# Altium schematic sheet LED.SchDoc: LED Cube 8x8x8 - LED
size A4; Author: Luka Penger; CompanyName: L. Penger; DrawnBy: Luka Penger; Organization: L. Penger; Address1: Luka Penger; Address2: http://lukapenger.eu; Address3: Software & Hardware; Address4: Development; DocumentNumber: 3; Revision: 3.0.0; SheetNumber: 3; SheetTotal: 5; DocumentName: LED; ProjectName: LED Cube 8x8x8
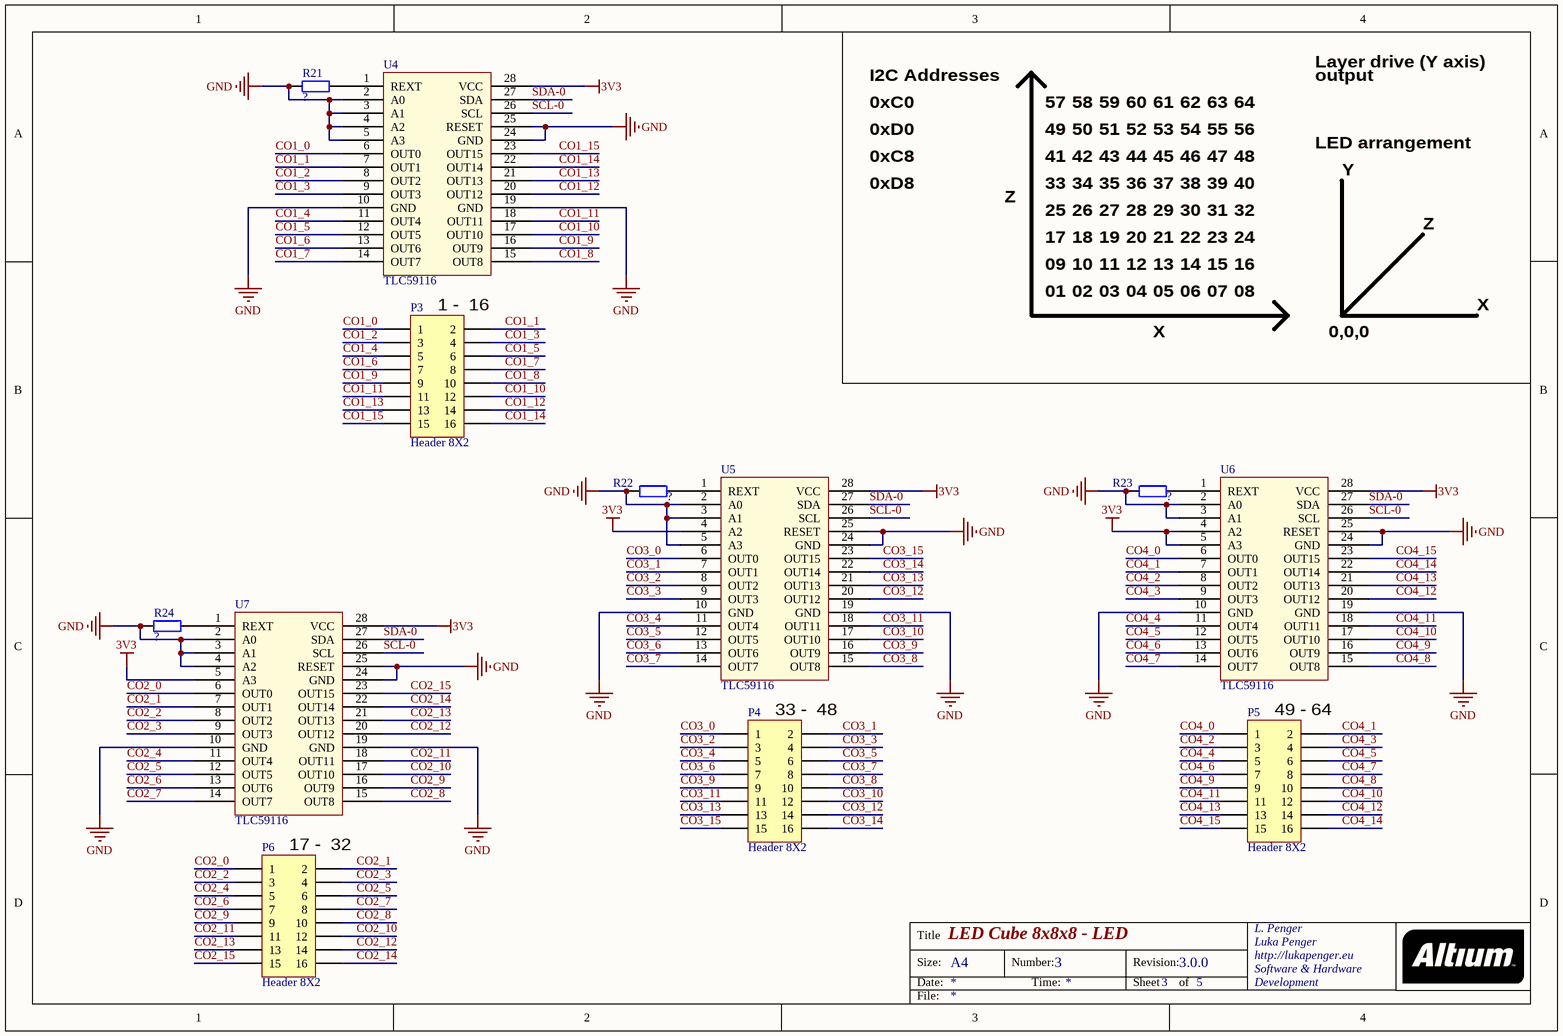
[diagram p0: LED.SchDoc]

## Parts
P3  Header 8X2  [IDC-2x8]
P4  Header 8X2  [IDC-2x8]
P5  Header 8X2  [IDC-2x8]
P6  Header 8X2  [IDC-2x8]
R21  ?  [1608[0603]]
R22  ?  [1608[0603]]
R23  ?  [1608[0603]]
R24  ?  [1608[0603]]
U4  TLC59116  [TSSOP28]
U5  TLC59116  [TSSOP28]
U6  TLC59116  [TSSOP28]
U7  TLC59116  [TSSOP28]

## Nets
3V3: U4.28(VCC) U5.4(A2) U5.28(VCC) U6.4(A2) U6.5(A3) U6.28(VCC) U7.5(A3) U7.28(VCC)
GND: R21.2 R22.1 R23.1 R24.2 U4.2(A0) U4.3(A1) U4.4(A2) U4.5(A3) U4.10(GND) U4.19(GND) U4.24(GND) U4.25(RESET) U5.2(A0) U5.3(A1) U5.5(A3) U5.10(GND) U5.19(GND) U5.24(GND) U5.25(RESET) U6.2(A0) U6.3(A1) U6.10(GND) U6.19(GND) U6.24(GND) U6.25(RESET) U7.2(A0) U7.3(A1) U7.4(A2) U7.10(GND) U7.19(GND) U7.24(GND) U7.25(RESET)
CO1_0: P3.1 U4.6(OUT0)
CO1_1: P3.2 U4.7(OUT1)
CO1_2: P3.3 U4.8(OUT2)
CO1_3: P3.4 U4.9(OUT3)
CO1_4: P3.5 U4.11(OUT4)
CO1_5: P3.6 U4.12(OUT5)
CO1_6: P3.7 U4.13(OUT6)
CO1_7: P3.8 U4.14(OUT7)
CO1_8: P3.10 U4.15(OUT8)
CO1_9: P3.9 U4.16(OUT9)
CO1_10: P3.12 U4.17(OUT10)
CO1_11: P3.11 U4.18(OUT11)
CO1_12: P3.14 U4.20(OUT12)
CO1_13: P3.13 U4.21(OUT13)
CO1_14: P3.16 U4.22(OUT14)
CO1_15: P3.15 U4.23(OUT15)
CO2_0: P6.1 U7.6(OUT0)
CO2_1: P6.2 U7.7(OUT1)
CO2_2: P6.3 U7.8(OUT2)
CO2_3: P6.4 U7.9(OUT3)
CO2_4: P6.5 U7.11(OUT4)
CO2_5: P6.6 U7.12(OUT5)
CO2_6: P6.7 U7.13(OUT6)
CO2_7: P6.8 U7.14(OUT7)
CO2_8: P6.10 U7.15(OUT8)
CO2_9: P6.9 U7.16(OUT9)
CO2_10: P6.12 U7.17(OUT10)
CO2_11: P6.11 U7.18(OUT11)
CO2_12: P6.14 U7.20(OUT12)
CO2_13: P6.13 U7.21(OUT13)
CO2_14: P6.16 U7.22(OUT14)
CO2_15: P6.15 U7.23(OUT15)
CO3_0: P4.1 U5.6(OUT0)
CO3_1: P4.2 U5.7(OUT1)
CO3_2: P4.3 U5.8(OUT2)
CO3_3: P4.4 U5.9(OUT3)
CO3_4: P4.5 U5.11(OUT4)
CO3_5: P4.6 U5.12(OUT5)
CO3_6: P4.7 U5.13(OUT6)
CO3_7: P4.8 U5.14(OUT7)
CO3_8: P4.10 U5.15(OUT8)
CO3_9: P4.9 U5.16(OUT9)
CO3_10: P4.12 U5.17(OUT10)
CO3_11: P4.11 U5.18(OUT11)
CO3_12: P4.14 U5.20(OUT12)
CO3_13: P4.13 U5.21(OUT13)
CO3_14: P4.16 U5.22(OUT14)
CO3_15: P4.15 U5.23(OUT15)
CO4_0: P5.1 U6.6(OUT0)
CO4_1: P5.2 U6.7(OUT1)
CO4_2: P5.3 U6.8(OUT2)
CO4_3: P5.4 U6.9(OUT3)
CO4_4: P5.5 U6.11(OUT4)
CO4_5: P5.6 U6.12(OUT5)
CO4_6: P5.7 U6.13(OUT6)
CO4_7: P5.8 U6.14(OUT7)
CO4_8: P5.10 U6.15(OUT8)
CO4_9: P5.9 U6.16(OUT9)
CO4_10: P5.12 U6.17(OUT10)
CO4_11: P5.11 U6.18(OUT11)
CO4_12: P5.14 U6.20(OUT12)
CO4_13: P5.13 U6.21(OUT13)
CO4_14: P5.16 U6.22(OUT14)
CO4_15: P5.15 U6.23(OUT15)
SCL-0: U4.26(SCL) U5.26(SCL) U6.26(SCL) U7.26(SCL)
SDA-0: U4.27(SDA) U5.27(SDA) U6.27(SDA) U7.27(SDA)
NetR21_1: R21.1 U4.1(REXT)
NetR22_2: R22.2 U5.1(REXT)
NetR23_2: R23.2 U6.1(REXT)
NetR24_1: R24.1 U7.1(REXT)

## Notes on the sheet
- I2C Addresses
- 0xC0
- 57
- 58
- 59
- 60
- 61
- 62
- 63
- 64
- Layer drive (Y axis)
- output
- 0xD0
- 0xC8
- 41
- 49
- 42
- 50
- 43
- 51
- 44
- 52
- 45
- 53
- 46
- 54
- 47
- 55
- 48
- 56
- LED arrangement
- Y
- 0xD8
- Z
- 17
- 25
- 33
- 18
- 26
- 34
- 19
- 27
- 35
- 20
- 28
- 36
- 21
- 29
- 37
- 22
- 30
- 38
- 23
- 31
- 39
- 24
- 32
- 40
- (near P3) 1 -  16
- 01
- 09
- 02
- 10
- 03
- 11
- 04
- 12
- 05
- 13
- 06
- 14
- 07
- 15
- 08
- 16
- X
- 0,0,0
- (near P4) 33 -  48
- (near P5) 49 - 64
- (near P6) 17 -  32
- Title
- Size:
- Date:
- A4
- Number:
- Time:
- Revision:
- Sheet
- of
- File:

## Library data of the parts
P3-P6 = Header 8X2: Header, 8-Pin, Dual row; LatestRevisionDate: 17-Jul-2002; LatestRevisionNote: Re-released for DXP Platform.; Publisher: Altium Limited
R21-R24 = Res2: Resistor; Value: 1K; Published: 8-Jun-2000; LatestRevisionDate: 17-Jul-2002; LatestRevisionNote: Re-released for DXP Platform.; PackageReference: AXIAL-0.4; Publisher: Altium Limited; PackageDescription: Axial Device, Thru-Hole; 2 Leads; 0.4 in Pin Spacing
U4-U7 = TLC59116: 16-Channel i2c LED driver